# EAGLE design stirrer_power_dpak (EAGLE 7.2.0)
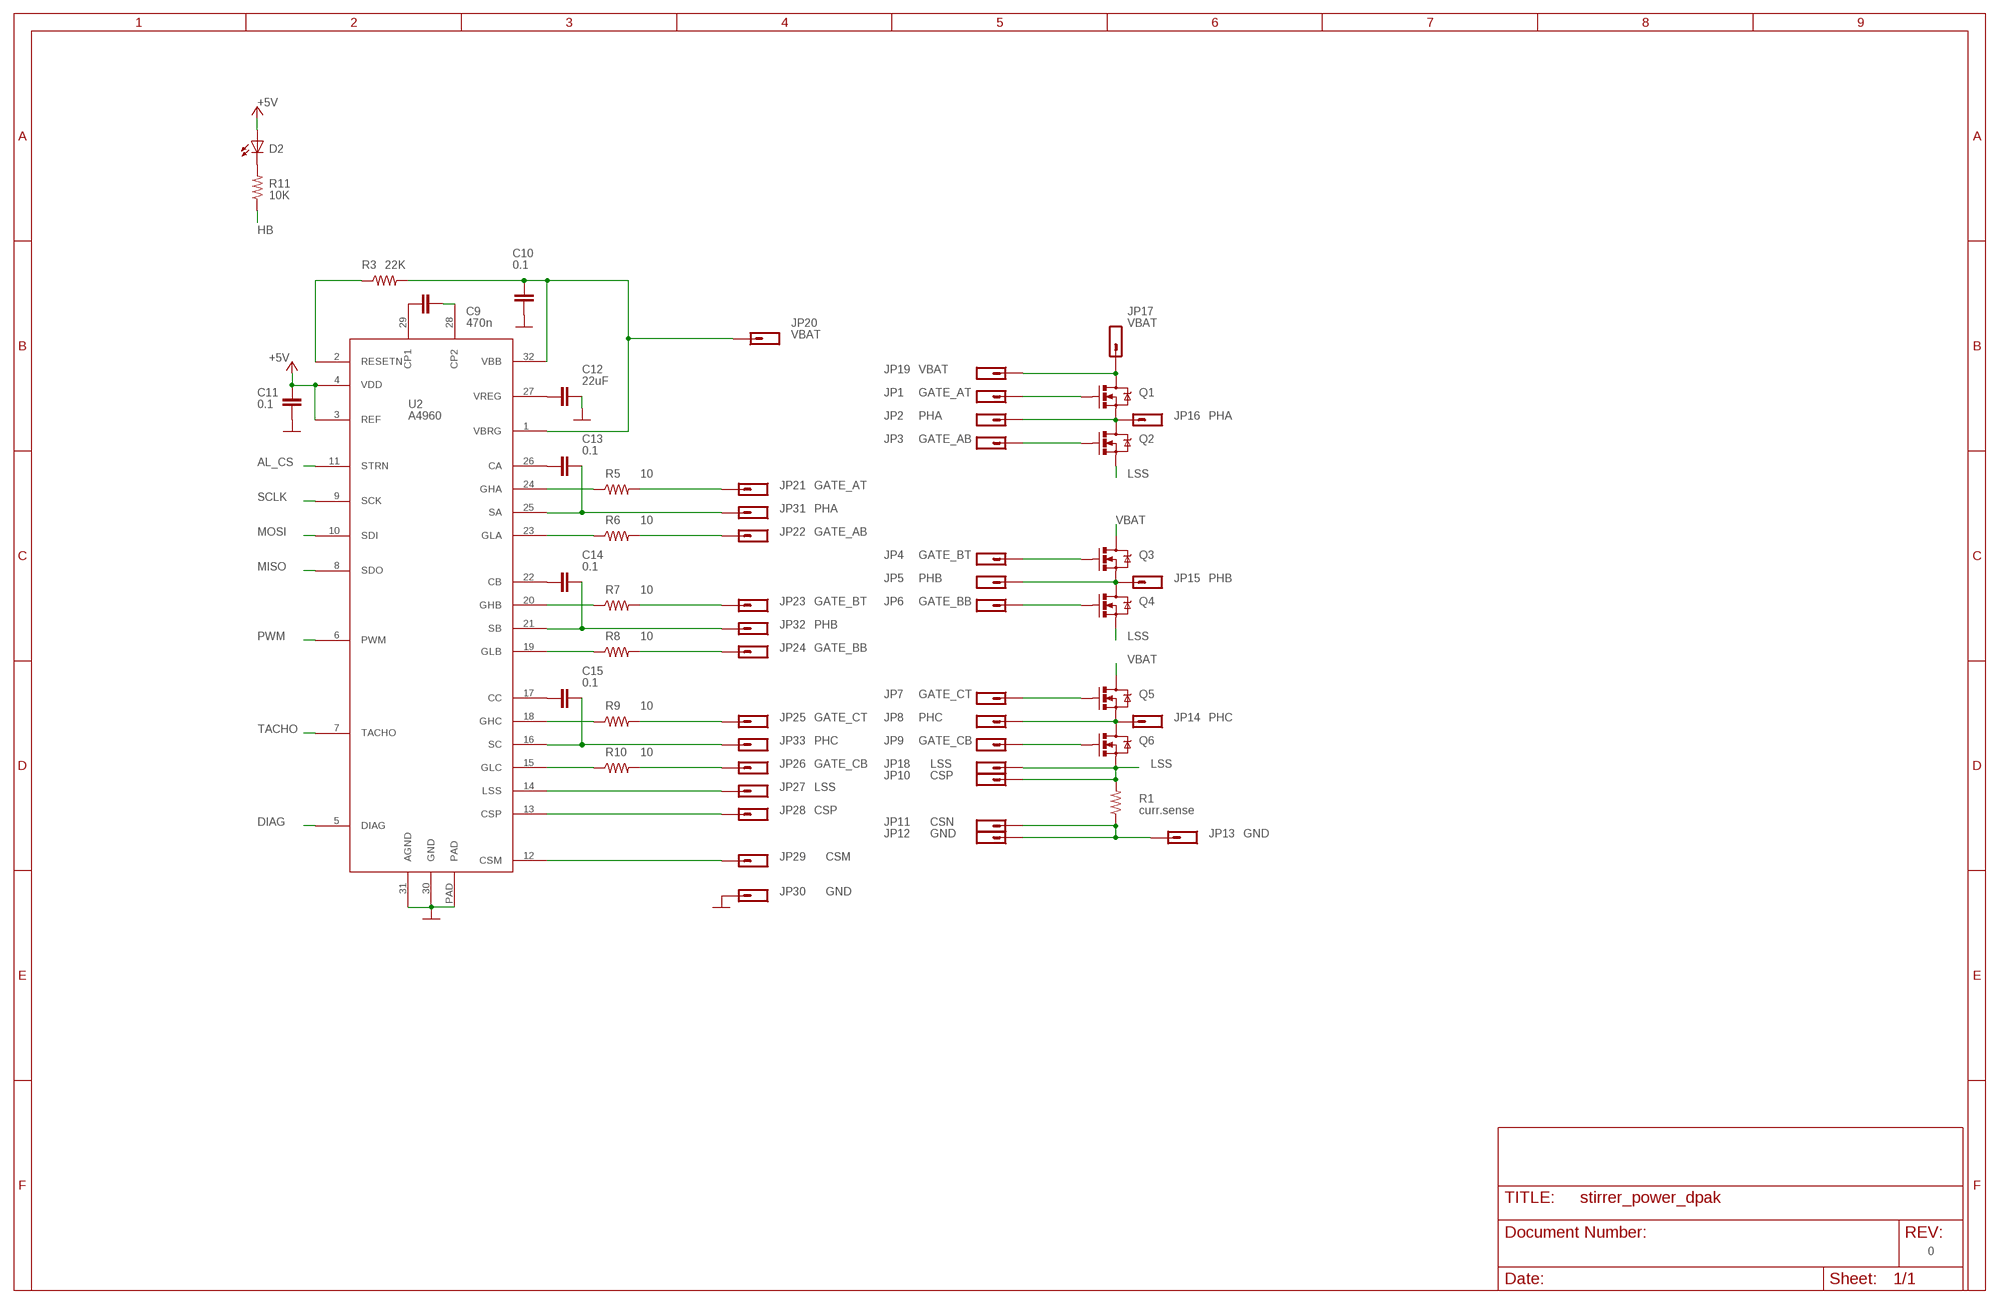
[diagram p0: schematic, sheet 1]

## Parts
C9  470n  C-0603  [0603]
C10  0.1  C-0603  [0603]
C11  0.1  C-0603  [0603]
C12  22uF  CAP1206  [1206]
C13  0.1  C-0603  [0603]
C14  0.1  C-0603  [0603]
C15  0.1  C-0603  [0603]
D2  LED5MM  [LED5MM]
JP1  GATE_AT  M01-TT  [1X01_TT]
JP2  PHA  M01-TT  [1X01_TT]
JP3  GATE_AB  M01-TT  [1X01_TT]
JP4  GATE_BT  M01-TT  [1X01_TT]
JP5  PHB  M01-TT  [1X01_TT]
JP6  GATE_BB  M01-TT  [1X01_TT]
JP7  GATE_CT  M01-TT  [1X01_TT]
JP8  PHC  M01-TT  [1X01_TT]
JP9  GATE_CB  M01-TT  [1X01_TT]
JP10  CSP  M01-TT  [1X01_TT]
JP11  CSN  M01-TT  [1X01_TT]
JP12  GND  M01-TT  [1X01_TT]
JP13  GND  M01-TT  [1X01_TT]
JP14  PHC  M01-TT  [1X01_TT]
JP15  PHB  M01-TT  [1X01_TT]
JP16  PHA  M01-TT  [1X01_TT]
JP17  VBAT  M01-TT  [1X01_TT]
JP18  LSS  M01-TT  [1X01_TT]
JP19  VBAT  M01-TT  [1X01_TT]
JP20  VBAT  M01-TT  [1X01_TT]
JP21  GATE_AT  M01-TT  [1X01_TT]
JP22  GATE_AB  M01-TT  [1X01_TT]
JP23  GATE_BT  M01-TT  [1X01_TT]
JP24  GATE_BB  M01-TT  [1X01_TT]
JP25  GATE_CT  M01-TT  [1X01_TT]
JP26  GATE_CB  M01-TT  [1X01_TT]
JP27  LSS  M01-TT  [1X01_TT]
JP28  CSP  M01-TT  [1X01_TT]
JP29  CSM  M01-TT  [1X01_TT]
JP30  GND  M01-TT  [1X01_TT]
JP31  PHA  M01-TT  [1X01_TT]
JP32  PHB  M01-TT  [1X01_TT]
JP33  PHC  M01-TT  [1X01_TT]
Q1  MOSFET-NCHANNEL-DPAK  [DPAK]
Q2  MOSFET-NCHANNEL-DPAK  [DPAK]
Q3  MOSFET-NCHANNEL-DPAK  [DPAK]
Q4  MOSFET-NCHANNEL-DPAK  [DPAK]
Q5  MOSFET-NCHANNEL-DPAK  [DPAK]
Q6  MOSFET-NCHANNEL-DPAK  [DPAK]
R1  curr.sense  RESISTOR-2512  [2512]
R3  22K  RESISTOR-0603  [0603]
R5  10  RESISTOR-0603  [0603]
R6  10  RESISTOR-0603  [0603]
R7  10  RESISTOR-0603  [0603]
R8  10  RESISTOR-0603  [0603]
R9  10  RESISTOR-0603  [0603]
R10  10  RESISTOR-0603  [0603]
R11  10K  RESISTOR-0603  [0603]
U2  A4960  [LQPF-32]

## Nets
+5V: C11.2 D2.A U2.3(REF) U2.4(VDD)
AL_CS: U2.11(STRN)
CSM: JP29.1 U2.12(CSM)
CSP: JP28.1 U2.13(CSP)
DIAG: U2.5(DIAG)
GATE_AB: JP22.1 R6.2
GATE_AT: JP21.1 R5.2
GATE_BB: JP24.1 R8.2
GATE_BT: JP23.1 R7.2
GATE_CB: JP26.1 R10.2
GATE_CT: JP25.1 R9.2
GND: C10.1 C11.1 C12.2 JP11.1 JP12.1 JP13.1 JP30.1 R1.P$1 U2.30(GND) U2.31(AGND) U2.PAD
HB: R11.1
LSS: JP10.1 JP18.1 Q2.3(S) Q4.3(S) Q6.3(S) R1.P$2
LSS1: JP27.1 U2.14(LSS)
MISO: U2.8(SDO)
MOSI: U2.10(SDI)
N$1: JP2.1 JP16.1 Q1.3(S) Q2.4(D)
N$2: JP5.1 JP15.1 Q3.3(S) Q4.4(D)
N$3: JP8.1 JP14.1 Q5.3(S) Q6.4(D)
N$4: JP1.1 Q1.1(G)
N$5: JP3.1 Q2.1(G)
N$6: C9.1 U2.29(CP1)
N$7: C9.2 U2.28(CP2)
N$8: R3.1 U2.2(RESETN)
N$9: D2.K(C) R11.2
N$10: JP4.1 Q3.1(G)
N$11: JP6.1 Q4.1(G)
N$14: JP7.1 Q5.1(G)
N$15: JP9.1 Q6.1(G)
N$16: C12.1 U2.27(VREG)
N$17: C13.2 U2.26(CA)
N$19: C14.2 U2.22(CB)
N$20: C15.2 U2.17(CC)
N$21: C13.1 JP31.1 U2.25(SA)
N$22: C14.1 JP32.1 U2.21(SB)
N$23: C15.1 JP33.1 U2.16(SC)
N$24: R5.1 U2.24(GHA)
N$25: R7.1 U2.20(GHB)
N$26: R9.1 U2.18(GHC)
N$27: R6.1 U2.23(GLA)
N$28: R8.1 U2.19(GLB)
N$29: R10.1 U2.15(GLC)
PWM: U2.6(PWM)
SCLK: U2.9(SCK)
TACHO: U2.7(TACHO)
VBAT: JP17.1 JP19.1 Q1.4(D) Q3.4(D) Q5.4(D)
VBAT1: C10.2 JP20.1 R3.2 U2.1(VBRG) U2.32(VBB)

## Notes on the sheet
- 0

## Library data of the parts
C9-C11 C13-C15 = ch_passive:C: CAPACITOR naming: grid - package width
C12 = ch_passive:CAP: Capacitor Standard 0603 ceramic capacitor, and 0.1" leaded capacitor.
D2 = ch_generic:LED: LEDs Standard schematic elements and footprints for 5mm, 3mm, 1206, and 0603 sized LEDs. 5mm - Spark Fun Electronics SKU : COM-00529 (and others)
JP1-JP33 = ch_connectors:M01: Header 1 Standard 1-pin 0.1" header. Use with straight break away headers (SKU : PRT-00116), right angle break away headers (PRT-00553), swiss pins (PRT-00743), machine pins (PRT-00117), and female headers (PRT-00115).
Q1-Q6 = ch_generic:MOSFET-NCHANNEL: MOSFET-N
R1 R3 R5-R11 = ch_passive:RESISTOR: Resistor Basic schematic elements and footprints for 0603, 1206, and PTH 1/10th watt (small) resistors.
U2 = ch_allegro:A4960

## Board
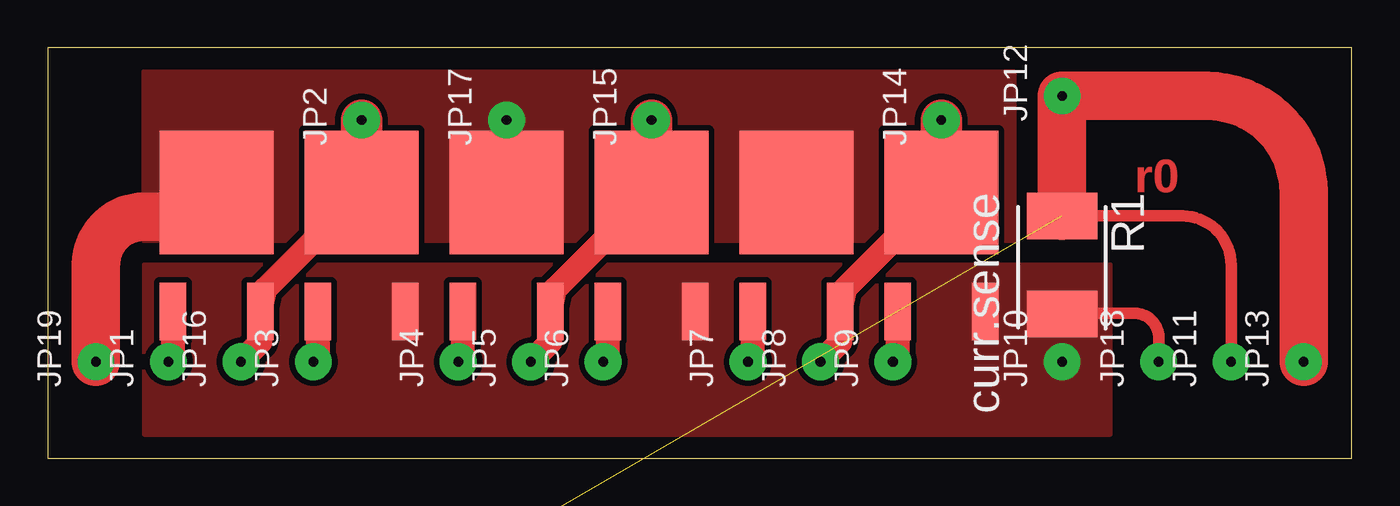
[diagram p1: board, top side]

Size 68.58 x 21.59 mm. Coordinates in mm from the lower left corner, seen from the top.
Outline: 68.58,0 68.58,21.57 0,21.59 0,0 68.58,0
Copper layers (1*16): Top 0.0356mm / dielectric 1.5011mm / Bottom 0.0356mm
Design rules "CH_TT": minimum track width 6mil, minimum drill 1mil, track to track 6mil, track to pad 6mil, pad to pad 6mil, via to via 6mil, smd to smd 6mil, copper to edge 15mil, drill to drill 6mil, minimum pad ring 7mil, minimum via ring 7mil, stop-mask expansion 4mil, vias tented up to drill 20mil, thermal gap 10mil

### Footprints (pad centres in the part's own frame; a part is rotated, then mirrored left to right if it is on the bottom)
0603 = smd 1.1 x 1: 1 -0.85,0; 2 0.85,0
1206 = smd 1.6 x 1.8: 1 -1.4,0; 2 1.4,0
LED5MM = drill 0.813: A -1.27,0; K 1.27,0
1X01_TT = drill 0.508 pad 1.93: 1 0,0
DPAK = smd 1.4 x 3: 1 -2.3,-6.25; 3 2.3,-6.25 | smd 6 x 6.5: 4 0,0
2512 = smd 2.45 x 3.7: P$1 -2.58,0; P$2 2.58,0
LQPF-32 = smd 0.45 x 1.8: 1 -2.8,-4.35; 2 -2,-4.35; 3 -1.2,-4.35; 4 -0.4,-4.35; 5 0.4,-4.35; 6 1.2,-4.35; 7 2,-4.35; 8 2.8,-4.35; 17 2.8,4.35; 18 2,4.35; 19 1.2,4.35; 20 0.4,4.35; 21 -0.4,4.35; 22 -1.2,4.35; 23 -2,4.35; 24 -2.8,4.35 | smd 1.8 x 0.45: 9 4.35,-2.8; 10 4.35,-2; 11 4.35,-1.2; 12 4.35,-0.4; 13 4.35,0.4; 14 4.35,1.2; 15 4.35,2; 16 4.35,2.8; 25 -4.35,2.8; 26 -4.35,2; 27 -4.35,1.2; 28 -4.35,0.4; 29 -4.35,-0.4; 30 -4.35,-1.2; 31 -4.35,-2; 32 -4.35,-2.8 | smd 5 x 5: PAD 0,0

### Placement (x,y rotation side)
C9  7.62,-44.45 0 top  (outside the outline)
C10  11.43,-44.45 0 top  (outside the outline)
C11  15.24,-44.45 0 top  (outside the outline)
C12  2.54,-45.72 0 top  (outside the outline)
C13  19.05,-44.45 0 top  (outside the outline)
C14  22.86,-44.45 0 top  (outside the outline)
C15  26.67,-44.45 0 top  (outside the outline)
D2  2.54,-54.61 0 top  (outside the outline)
JP1  6.35,5.08 90 top
JP2  16.51,17.78 90 top
JP3  13.97,5.08 90 top
JP4  21.59,5.08 90 top
JP5  25.4,5.08 90 top
JP6  29.21,5.08 90 top
JP7  36.83,5.08 90 top
JP8  40.64,5.08 90 top
JP9  44.45,5.08 90 top
JP10  53.34,5.08 90 top
JP11  62.23,5.08 90 top
JP12  53.34,19.05 90 top
JP13  66.04,5.08 90 top
JP14  46.99,17.78 90 top
JP15  31.75,17.78 90 top
JP16  10.16,5.08 90 top
JP17  24.13,17.78 90 top
JP18  58.42,5.08 90 top
JP19  2.54,5.08 90 top
JP20  11.43,-31.75 0 top  (outside the outline)
JP21  12.7,-13.97 0 top  (outside the outline)
JP22  22.86,-13.97 0 top  (outside the outline)
JP23  1.27,-24.13 0 top  (outside the outline)
JP24  11.43,-24.13 0 top  (outside the outline)
JP25  21.59,-24.13 0 top  (outside the outline)
JP26  1.27,-31.75 0 top  (outside the outline)
JP27  17.78,-31.75 0 top  (outside the outline)
JP28  24.13,-31.75 0 top  (outside the outline)
JP29  1.27,-39.37 0 top  (outside the outline)
JP30  7.62,-39.37 0 top  (outside the outline)
JP31  13.97,-39.37 0 top  (outside the outline)
JP32  20.32,-39.37 0 top  (outside the outline)
JP33  26.67,-39.37 0 top  (outside the outline)
Q1  8.89,13.97 0 top
Q2  16.51,13.97 0 top
Q3  24.13,13.97 0 top
Q4  31.75,13.97 0 top
Q5  39.37,13.97 0 top
Q6  46.99,13.97 0 top
R1  53.34,10.16 270 top
R3  30.48,-44.45 0 top  (outside the outline)
R5  1.27,-49.53 0 top  (outside the outline)
R6  5.08,-49.53 0 top  (outside the outline)
R7  8.89,-49.53 0 top  (outside the outline)
R8  12.7,-49.53 0 top  (outside the outline)
R9  16.51,-49.53 0 top  (outside the outline)
R10  20.32,-49.53 0 top  (outside the outline)
R11  1.27,-59.69 0 top  (outside the outline)
U2  5.08,-15.24 0 top  (outside the outline)

### Tracks (layer width: path | path; a pad name or v marks a point on that pad's centre or on a via)
+5V  (3 unrouted)
CSM  (1 unrouted)
CSP  (1 unrouted)
GATE_AB  (1 unrouted)
GATE_AT  (1 unrouted)
GATE_BB  (1 unrouted)
GATE_BT  (1 unrouted)
GATE_CB  (1 unrouted)
GATE_CT  (1 unrouted)
GND  (7 unrouted)
  Top 0.61: R1.P$1 59.65,12.74 arc-90 62.23,10.16 JP11.1
  Top 2.54: JP13.1 66.04,13.97 arc90 60.96,19.05 JP12.1 R1.P$1
LSS
  Top 0.61: JP18.1 58.42,6.35 arc90 57.15,7.62 53.38,7.62 R1.P$2
  pour Top (isolate 0.305, no thermals): 5.08,10.16 5.08,1.27 55.88,1.27 55.88,10.16
LSS1  (1 unrouted)
N$1
  Top 1.27: Q2.4 11.43,8.89 Q1.3 11.19,6.11 JP16.1
  Top 2.184: Q2.4 JP2.1
N$2
  Top 1.27: Q4.4 26.67,8.89 Q3.3 26.43,6.11 JP5.1
  Top 2.184: Q4.4 JP15.1
N$3
  Top 1.27: Q6.4 41.91,8.89 Q5.3 41.67,6.11 JP8.1
  Top 2.184: Q6.4 JP14.1
N$4
  Top 1.27: Q1.1 6.59,5.32 JP1.1
N$5
  Top 1.27: Q2.1 14.21,5.32 JP3.1
N$6  (1 unrouted)
N$7  (1 unrouted)
N$8  (1 unrouted)
N$9  (1 unrouted)
N$10
  Top 1.27: Q3.1 21.83,5.32 JP4.1
N$11
  Top 1.27: Q4.1 29.45,5.32 JP6.1
N$14
  Top 1.27: Q5.1 37.07,5.32 JP7.1
N$15
  Top 1.27: Q6.1 44.69,5.32 JP9.1
N$16  (1 unrouted)
N$17  (1 unrouted)
N$19  (1 unrouted)
N$20  (1 unrouted)
N$21  (2 unrouted)
N$22  (2 unrouted)
N$23  (2 unrouted)
N$24  (1 unrouted)
N$25  (1 unrouted)
N$26  (1 unrouted)
N$27  (1 unrouted)
N$28  (1 unrouted)
N$29  (1 unrouted)
VBAT
  Top 2.54: JP19.1 2.54,10.16 arc-90 5.08,12.7 7.62,12.7 arc-90 Q1.4
  pour Top (isolate 0.305, no thermals): 5.08,11.43 5.08,20.32 50.8,20.32 50.8,11.43
VBAT1  (4 unrouted)

### Text on the board
Top: r0